# Altium project SparkGapProject.PrjPcb
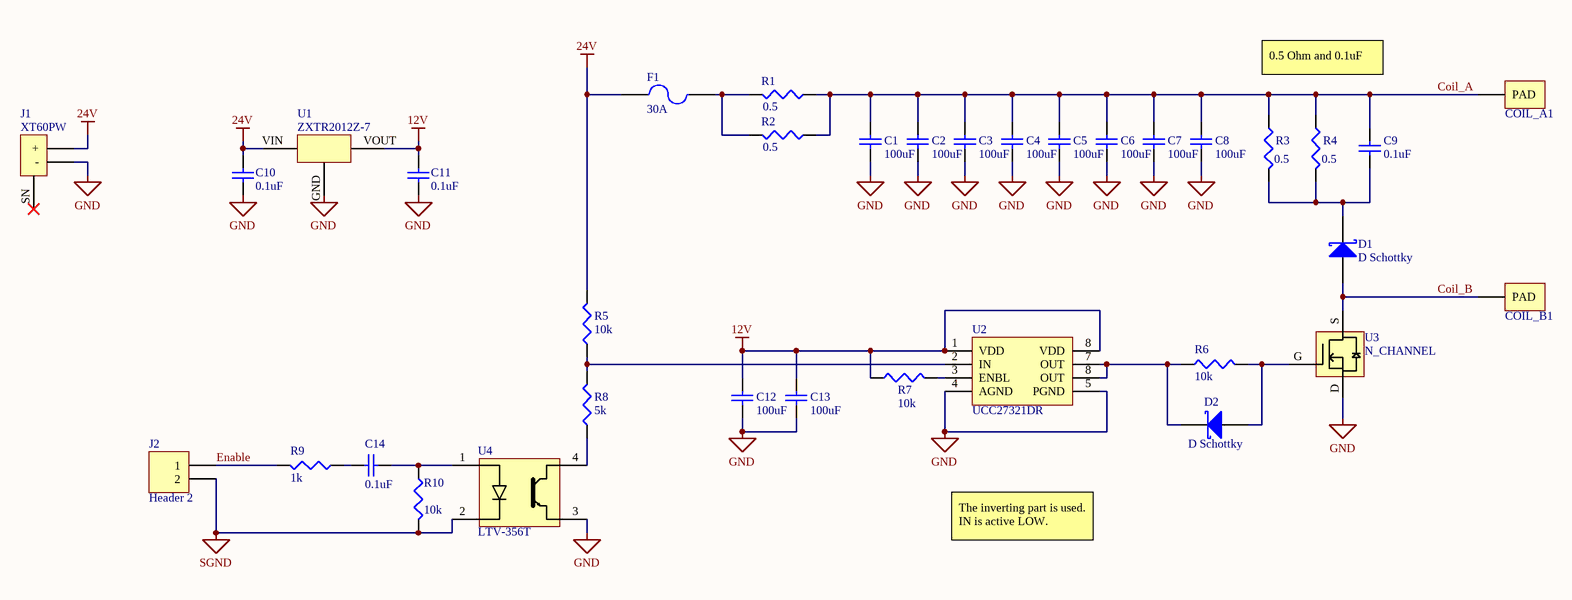
[diagram p0: SparkGapSchematic.SchDoc]
1 sheet, 35 parts. Net scope: global (net labels, ports and power ports of the same name join across sheets).
Board file: SparkGapPcb.PcbDoc

## Sheet SparkGapSchematic.SchDoc
size B

### Parts
C1  value 100uF  [CAP_40mm]  (hidden comment: Cap)
C2  value 100uF  [CAP_40mm]  (hidden comment: Cap)
C3  value 100uF  [CAP_40mm]  (hidden comment: Cap)
C4  value 100uF  [CAP_40mm]  (hidden comment: Cap)
C5  value 100uF  [CAP_40mm]  (hidden comment: Cap)
C6  value 100uF  [CAP_40mm]  (hidden comment: Cap)
C7  value 100uF  [CAP_40mm]  (hidden comment: Cap)
C8  value 100uF  [CAP_40mm]  (hidden comment: Cap)
C9  value 0.1uF  [6-0805_L]  (hidden comment: Cap)
C10  value 0.1uF  [6-0805_L]  (hidden comment: Cap)
C11  value 0.1uF  [6-0805_L]  (hidden comment: Cap)
C12  value 100uF  [6-0805_L]  (hidden comment: Cap)
C13  value 100uF  [6-0805_L]  (hidden comment: Cap)
C14  value 0.1uF  [6-0805_L]  (hidden comment: Cap)
COIL_A1  PAD  [PAD]  (value not drawn)
COIL_B1  PAD  [PAD]  (value not drawn)
D1  D Schottky  [SMB]
D2  D Schottky  [SOD123F]
F1  30A  [FUSE_HOLDER]
J1  XT60PW  [XT60PW]
J2  Header 2  [HDR1X2]
R1  value 0.5  [12Z-2010]  (hidden comment: Res3)
R2  value 0.5  [12Z-2010]  (hidden comment: Res3)
R3  value 0.5  [12Z-2010]  (hidden comment: Res3)
R4  value 0.5  [12Z-2010]  (hidden comment: Res3)
R5  value 10k  [6-0805_L]  (hidden comment: Res3)
R6  value 10k  [6-0805_L]  (hidden comment: Res3)
R7  value 10k  [6-0805_L]  (hidden comment: Res3)
R8  value 5k  [6-0805_L]  (hidden comment: Res3)
R9  value 1k  [6-0805_L]  (hidden comment: Res3)
R10  10k  [6-0805_L]
U1  ZXTR2012Z-7  [ZXTR2012Z]
U2  UCC27321DR  [Gate_Driver_UCC27321DR]
U3  N_CHANNEL  [N_CH_SUG90090E]
U4  LTV-356T  [OptoIsolator_LTV-356T-B]

### Nets
12V: C11.2 C12.2 C13.2 R7.1 U1.VOUT U2.1(VDD) U2.8(VDD)
24V: C10.2 F1.1 J1.+ R5.2 U1.VIN
GND: C1.1 C2.1 C3.1 C4.1 C5.1 C6.1 C7.1 C8.1 C10.1 C11.1 C12.1 C13.1 J1.- U1.GND U2.4(AGND) U2.5(PGND) U3.D U4.3(Emmiter)
SGND: J2.2 R10.2 U4.2(Cathode)
Coil_A: C1.2 C2.2 C3.2 C4.2 C5.2 C6.2 C7.2 C8.2 C9.2 COIL_A1.PAD R1.1 R2.1 R3.1 R4.1
Coil_B: COIL_B1.PAD D1.1(A) U3.S
Enable: J2.1 R9.2
NetC9_1: C9.1 D1.2(K) R3.2 R4.2
NetC14_1: C14.1 R10.1 U4.1(Anode)
NetC14_2: C14.2 R9.1
NetD2_1: D2.1(A) R6.2 U3.G
NetD2_2: D2.2(K) R6.1 U2.7(OUT) U2.8(OUT)
NetF1_2: F1.2 R1.2 R2.2
NetR5_1: R5.1 R8.2 U2.2(IN)
NetR7_2: R7.2 U2.3(ENBL)
NetR8_1: R8.1 U4.4(Collector)

Not connected (* = marked no-connect by the designer): J1 SN*

### Notes on the sheet
- 0.5 Ohm and 0.1uF
- The inverting part is used. IN is active LOW.

### Library data of the parts
C1-C14 = Cap: Capacitor; Published: 8-Jun-2000; LatestRevisionDate: 17-Jul-2002; LatestRevisionNote: Re-released for DXP Platform.; PackageReference: RAD-0.3; Publisher: Altium Limited; PackageDescription: Radial Cap, Thru-Hole; 2 Leads; 0.3 in Pin Spacing
D1 D2 = D Schottky: Schottky Diode; Published: 8-Jun-2000; LatestRevisionDate: 17-Jul-2002; LatestRevisionNote: Re-released for DXP Platform.; PackageReference: SMB; Publisher: Altium Limited; PackageDescription: DO-214-AA/SMB; 2 C-Bend Leads; Body 5.3 x 3.6 mm, inc. leads (LxW); Code_JEDEC: DO-214-AA
F1 = Fuse 2: Fuse; Published: 8-Jun-2000; LatestRevisionDate: 17-Jul-2002; LatestRevisionNote: Re-released for DXP Platform.; PackageReference: PIN-W2/E2.8; Publisher: Altium Limited; PackageDescription: Thru-Hole; 2 Leads
J2 = Header 2: Header, 2-Pin; LatestRevisionDate: 17-Jul-2002; LatestRevisionNote: Re-released for DXP Platform.; Publisher: Altium Limited
R1-R10 = Res3: Resistor; Published: 8-Jun-2000; LatestRevisionDate: 29-May-2009; LatestRevisionNote: IPC-7351 Footprint Added.; PackageReference: J1-0603; Publisher: Altium Limited; PackageDescription: Chip Resistor
  R10: Value: 10k